# EAGLE design H4_PadController_Rev_1 (EAGLE 7.6.0)
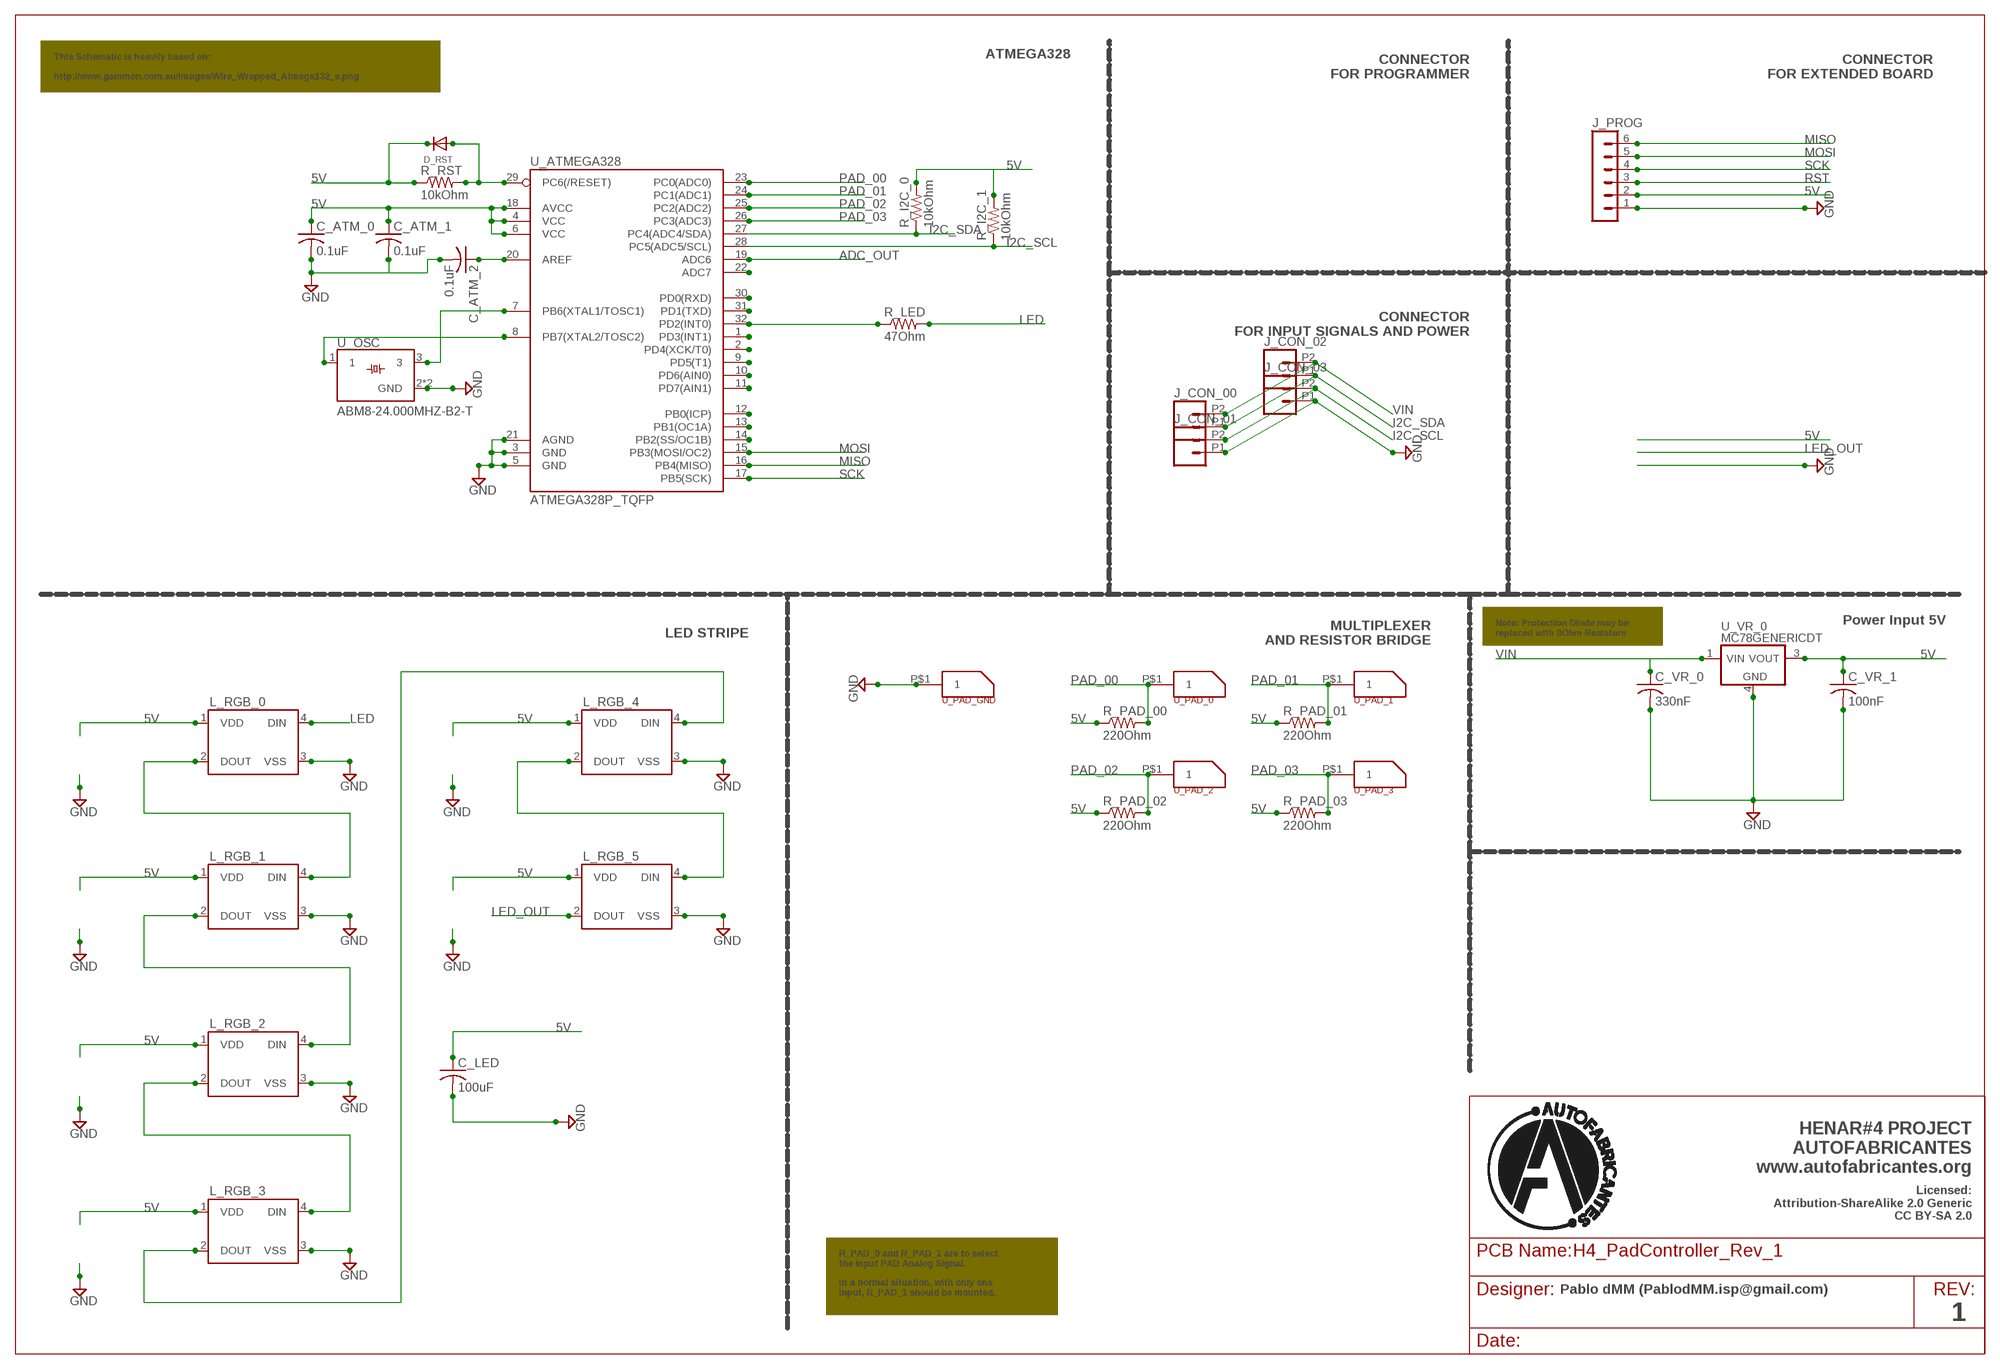
[diagram p0: schematic, sheet 1]

## Parts
C_ATM_0  0.1uF  C-USC0805  [C0805]
C_ATM_1  0.1uF  C-USC0805  [C0805]
C_ATM_2  0.1uF  C-USC0805  [C0805]
C_LED  100uF  C-USC1210  [C1210]
C_VR_0  330nF  C-USC0805  [C0805]
C_VR_1  100nF  C-USC0805  [C0805]
D_RST  DIODESOD-123  [SOD-123]
J_CON_00  M022.54MM_SCREWTERM  [1X02_2.54_SCREWTERM]
J_CON_01  M022.54MM_SCREWTERM  [1X02_2.54_SCREWTERM]
J_CON_02  M022.54MM_SCREWTERM  [1X02_2.54_SCREWTERM]
J_CON_03  M022.54MM_SCREWTERM  [1X02_2.54_SCREWTERM]
J_PROG  MA06-1  [MA06-1]
L_RGB_0  WS2812B  [WS2812B]
L_RGB_1  WS2812B  [WS2812B]
L_RGB_2  WS2812B  [WS2812B]
L_RGB_3  WS2812B  [WS2812B]
L_RGB_4  WS2812B  [WS2812B]
L_RGB_5  WS2812B  [WS2812B]
R_I2C_0  10kOhm  R-US_M0805  [M0805]
R_I2C_1  10kOhm  R-US_M0805  [M0805]
R_LED  47Ohm  R-US_M0805  [M0805]
R_PAD_00  220Ohm  R-US_M0805  [M0805]
R_PAD_01  220Ohm  R-US_M0805  [M0805]
R_PAD_02  220Ohm  R-US_M0805  [M0805]
R_PAD_03  220Ohm  R-US_M0805  [M0805]
R_RST  10kOhm  R-US_M0805  [M0805]
U_ATMEGA328  ATMEGA328P_TQFP  [TQFP32-08]
U_OSC  ABM8-24.000MHZ-B2-T  [OSCSC320X250X100N]
U_PAD_0  PAD_CONNECTOR_MULTI  [PAD_CONNECTOR_MULTI]
U_PAD_1  PAD_CONNECTOR_MULTI  [PAD_CONNECTOR_MULTI]
U_PAD_2  PAD_CONNECTOR_MULTI  [PAD_CONNECTOR_MULTI]
U_PAD_3  PAD_CONNECTOR_MULTI  [PAD_CONNECTOR_MULTI]
U_PAD_GND  PAD_CONNECTOR_MULTI  [PAD_CONNECTOR_MULTI]
U_VR_0  MC78GENERICDT  [DPAK-3]

## Nets
5V [GND]: C_ATM_0.1 C_ATM_1.1 C_LED.1 C_VR_1.1 D_RST.C J_PROG.2 L_RGB_0.1(VDD) L_RGB_1.1(VDD) L_RGB_2.1(VDD) L_RGB_3.1(VDD) L_RGB_4.1(VDD) L_RGB_5.1(VDD) R_I2C_0.2 R_I2C_1.2 R_PAD_00.1 R_PAD_01.1 R_PAD_02.1 R_PAD_03.1 R_RST.1 U_ATMEGA328.4(VCC) U_ATMEGA328.6(VCC) U_ATMEGA328.18(AVCC) U_VR_0.3(VOUT)
ADC_OUT: U_ATMEGA328.19(ADC6)
GND [GND]: C_ATM_0.2 C_ATM_1.2 C_ATM_2.2 C_LED.2 C_VR_0.2 C_VR_1.2 J_CON_01.P1 J_CON_03.P1 J_PROG.1 L_RGB_0.3(VSS) L_RGB_1.3(VSS) L_RGB_2.3(VSS) L_RGB_3.3(VSS) L_RGB_4.3(VSS) L_RGB_5.3(VSS) U_ATMEGA328.3(GND) U_ATMEGA328.5(GND) U_ATMEGA328.21(AGND) U_OSC.2(GND) U_OSC.4(GND) U_PAD_GND.P$1 U_VR_0.4(GND)
I2C_SCL: J_CON_01.P2 J_CON_03.P2 R_I2C_1.1 U_ATMEGA328.28(PC5(ADC5/SCL))
I2C_SDA: J_CON_00.P1 J_CON_02.P1 R_I2C_0.1 U_ATMEGA328.27(PC4(ADC4/SDA))
LED: L_RGB_0.4(DIN) R_LED.2
LED_OUT: L_RGB_5.2(DOUT)
LEDE: L_RGB_3.2(DOUT) L_RGB_4.4(DIN)
MISO: J_PROG.6 U_ATMEGA328.16(PB4(MISO))
MOSI: J_PROG.5 U_ATMEGA328.15(PB3(MOSI/OC2))
N$1: U_ATMEGA328.30(PD0(RXD))
N$2: U_ATMEGA328.7(PB6(XTAL1/TOSC1)) U_OSC.3
N$3: L_RGB_2.2(DOUT) L_RGB_3.4(DIN)
N$4: C_ATM_2.1 U_ATMEGA328.20(AREF)
N$5: U_ATMEGA328.8(PB7(XTAL2/TOSC2)) U_OSC.1
N$6: U_ATMEGA328.31(PD1(TXD))
N$8: R_LED.1 U_ATMEGA328.32(PD2(INT0))
N$9: L_RGB_1.2(DOUT) L_RGB_2.4(DIN)
N$10: L_RGB_0.2(DOUT) L_RGB_1.4(DIN)
N$13: U_ATMEGA328.22(ADC7)
N$14: L_RGB_4.2(DOUT) L_RGB_5.4(DIN)
N$16: U_ATMEGA328.1(PD3(INT1))
N$17: U_ATMEGA328.2(PD4(XCK/T0))
N$18: U_ATMEGA328.9(PD5(T1))
N$19: U_ATMEGA328.10(PD6(AIN0))
N$20: U_ATMEGA328.11(PD7(AIN1))
N$21: U_ATMEGA328.12(PB0(ICP))
N$22: U_ATMEGA328.13(PB1(OC1A))
N$23: U_ATMEGA328.14(PB2(SS/OC1B))
PAD_00: R_PAD_00.2 U_ATMEGA328.23(PC0(ADC0)) U_PAD_0.P$1
PAD_01: R_PAD_01.2 U_ATMEGA328.24(PC1(ADC1)) U_PAD_1.P$1
PAD_02: R_PAD_02.2 U_ATMEGA328.25(PC2(ADC2)) U_PAD_2.P$1
PAD_03: R_PAD_03.2 U_ATMEGA328.26(PC3(ADC3)) U_PAD_3.P$1
RST: D_RST.A J_PROG.3 R_RST.2 U_ATMEGA328.29(PC6(/RESET))
SCK: J_PROG.4 U_ATMEGA328.17(PB5(SCK))
VIN: C_VR_0.1 J_CON_00.P2 J_CON_02.P2 U_VR_0.1(VIN)

## Notes on the sheet
- This Schematic is heavily based on:
  
  http://www.gammon.com.au/images/Wire_Wrapped_Atmega132_e.png
- ATMEGA328
- CONNECTOR
  FOR PROGRAMMER
- CONNECTOR
  FOR EXTENDED BOARD
- CONNECTOR
  FOR INPUT SIGNALS AND POWER
- Note: Protection Diode may be
  replaced with 0Ohm Resistors
- Power Input 5V
- LED STRIPE
- MULTIPLEXER
  AND RESISTOR BRIDGE
- HENAR#4 PROJECT
  AUTOFABRICANTES
  www.autofabricantes.org
- Licensed:
  Attribution-ShareAlike 2.0 Generic
  CC BY-SA 2.0
- R_PAD_0 and R_PAD_1 are to select
  the Input PAD Analog Signal.
  
  In a normal situation, with only one
  Input, R_PAD_1 should be mounted.
- Pablo dMM (PablodMM.isp@gmail.com)
- 1

## Library data of the parts
C_ATM_0 C_ATM_1 C_ATM_2 C_LED C_VR_0 C_VR_1 = adafruit:C-US: CAPACITOR, American symbol
D_RST = microbuilder:DIODE: Diode SMA Model Volts Amps Type Vf Vr Digikey # Notes SSA34-E3 40V 3A Schottky 480mV @ 3A 200uA @ 40V SSA34-E3/61TGITR-ND CDBA120-G 20V 1A Schottky 500mV @ 1A 500uA @ 20V 641-1014-6-ND REEL MBRA210 10V 2A Schottky 350mV @ 2A 700uA @ 10V MBRA210LT3 SOD-123 Model Volts Amps Type Vf Vr Order # Notes BAT54T1G 30V 200mA Schottky 800mV @ 200mA 2uA @ 25V BAT54T1GOSTR-ND B0530W 30V 500mA Schottky 430mV @ 500mA 130uA @ 30V B0530W-FDICT-ND REEL MBR120 1A 20V Schottky 340mV @ 1A MBR120VLSFT1GOSCT-ND SOD-323 Model Volts Amps Type Vf Vr Order # Notes PMEG2005EJ 20V 500mA Schottky 355mV @ 500mA 568-4110-1-ND ZLLS410 10V 570mA Schottky 380mV @ 570mA ZLLS410CT-ND 1N4148WS 75V 150mA Silicon/Simple 1V 1N4148WSFSCT-ND REEL SOD-523 Model Volts Amps Type Vf Vr Order # Notes BAT54XV2 30V 200mA Schottky 0.8V @ 100mA BAT54XV2CT-ND TB751S 30V 30mA Schottky RB751S-40TE61CT-ND SOT23-R/W (R = Solder Paste/Reflow Ovens, W = Hand-Soldering) Model Volts Amps Type Vf Vr Order # Notes BAT54FILM 40V 300mA Schottky 497-7162-1-ND
J_CON_00 J_CON_01-J_CON_03 = SparkFun-Connectors:M02: Standard 2-pin 0.1" header. Use with - straight break away headers ( PRT-00116) - right angle break away headers (PRT-00553) - swiss pins (PRT-00743) - machine pins (PRT-00117) - female headers (PRT-00115) Molex polarized connector foot print use with: PRT-08233 with associated crimp pins and housings. 2.54_SCREWTERM for use with PRT-10571. 3.5mm Screw Terminal footprints for PRT-08084 5mm Screw Terminal footprints for use with PRT-08432
J_PROG = con-lstb:MA06-1: PIN HEADER; OC_FARNELL: unknown; OC_NEWARK: unknown
L_RGB_0 L_RGB_1-L_RGB_5 = SparkFun-LED:WS2812B: WS2812B - Intelligent control LED integrated light source Technical Specifications: Power Supply Voltage (VDD): 3.5 to 5.3 V Input Voltage (VI): -0.5 to VDD+0.5 V Operating Junction Temperature (Topt): -25°C to +80°C Storage Temperature Range (Tstg): -55°C to +150°C; PROD_ID: DIO-12503
R_I2C_0 R_I2C_1 R_LED R_PAD_00 R_PAD_01-R_PAD_03 R_RST = adafruit:R-US_: RESISTOR, American symbol
U_ATMEGA328 = SparkFun-DigitalIC:ATMEGA328P_TQFP; PROD_ID: IC-09069
U_OSC = ABM8-24.000MHZ-B2-T:ABM8-24.000MHZ-B2-T: Crystal 20MHz Â±20ppm (Tol) Â±30ppm (Stability) 18pF FUND 80Ohm 4-Pin Mini-CSMD T/R; AVAILABILITY: Unavailable; DESCRIPTION: 24MHz ±20ppm Crystal 18pF 50 Ohms 4-SMD, No Lead; MF: Abracon; MP: ABM8-24.000MHZ-B2-T; PACKAGE: SMD-4 Abracon; PRICE: None
U_PAD_0 U_PAD_1-U_PAD_3 U_PAD_GND = atfHenar_customLib:PAD_CONNECTOR_MULTI
U_VR_0 = _hhn_78xx_79xx_NCV78xx_d2pak_dpak:MC78*: 78xx SMD (D2PAK, DPAK) (MC)78xx..DT (DPAK-3; Rth,JA = 92 K/W) (MC)78xx..D2T (D2PAK-3; Rth,JA = 45 K/W @ 10x10mm copper area) Linear Voltage Regulators, Positive, 1 A (ON Semiconductor) Package dimenisions and soldering footprints acc. to ONSEMI specs. Source: http://onsemi.com Datasheet document#: MC7800/D Technologies: 78xxyD(2)Tz: xx = Output Voltage (V) y, z: additional suffixes see manufacturer's datasheet Author: Dipl.-Ing. FH Rainer Bayer HHN Hochschule Heilbronn, rainer.bayer@hs-heilbronn.de Ingenieurbüro ing-rb, mail@ing-rb.de

## Net classes
1 GND: width 0.381 mm
2 VCC: width 0.381 mm, clearance 0.305 mm to class 1

## Board
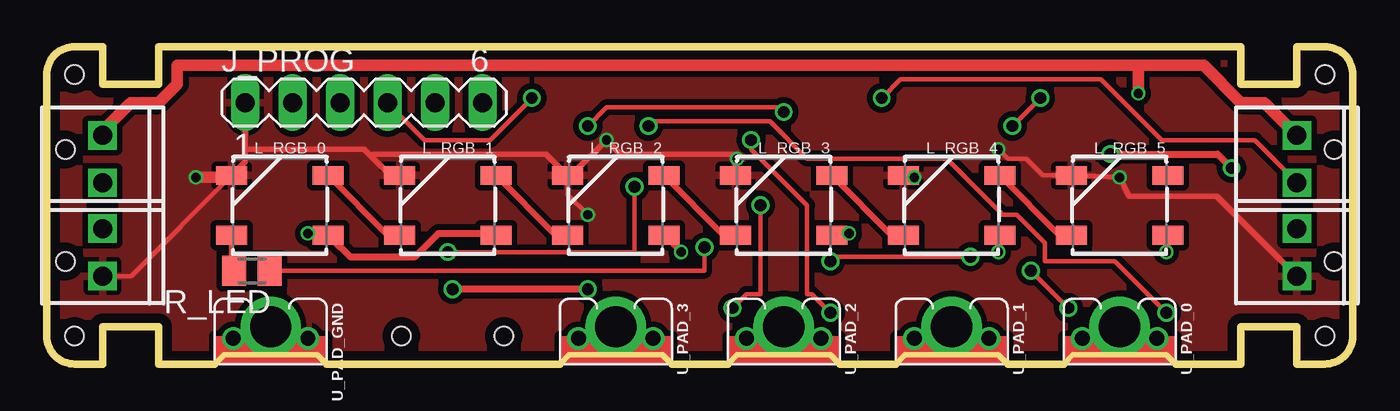
[diagram p1: board, top side]
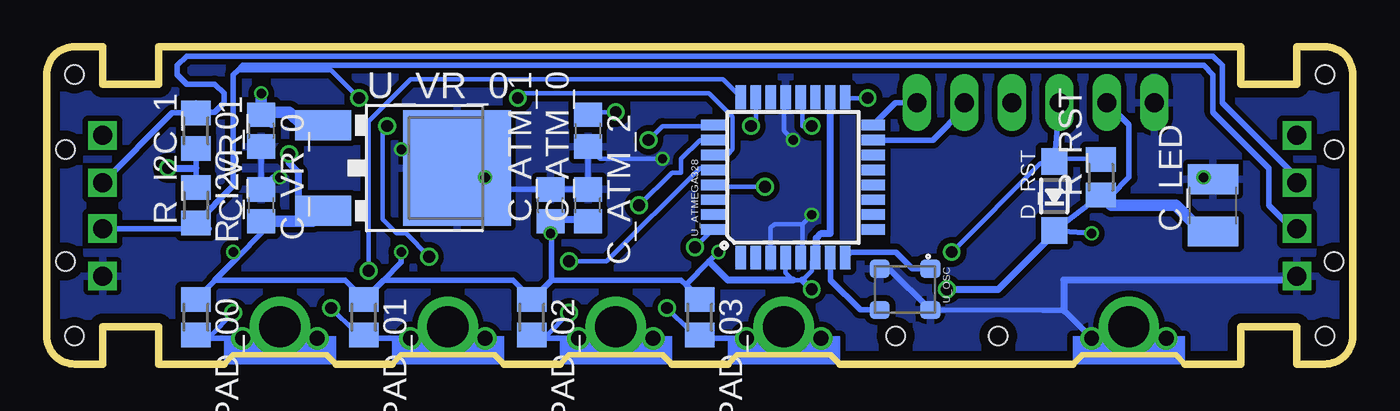
[diagram p2: board, bottom side, seen from below]

Size 70 x 17 mm. Coordinates in mm from the lower left corner, seen from the top.
Outline: 1.5,0 3,0 3,2 6,2 6,0 9,0 9.5,0.5 14.5,0.5 15,0 27.5,0 28,0.5 33,0.5 33.5,0 36.5,0 37,0.5 42,0.5 42.5,0 45.5,0 46,0.5 51,0.5 51.5,0 54.5,0 55,0.5 60,0.5 60.5,0 64,0 64,2 67,2 67,0 68.5,0 arc90 70,1.5 70,15.5 arc90 68.5,17 67,17 67,15 64,15 64,17 6,17 6,15 3,15 3,17 1.5,17 arc90 0,15.5 0,1.5 arc90 1.5,0
Copper layers (1*16): Top 0.035mm / dielectric 1.5mm / Bottom 0.035mm
Design rules "default *": minimum track width 10mil, minimum drill 25mil, track to track 10mil, track to pad 10mil, pad to pad 10mil, via to via 10mil, smd to smd 8mil, copper to edge 20mil, drill to drill 8mil, minimum pad ring 5mil, minimum via ring 5mil, stop-mask expansion 4mil, vias tented up to drill 0mil, thermal gap 10mil
Holes 1 mm at 69,5.5 69,11.5 1,11.5 1,5.5 68.5,15.5 68.5,1.5 1.5,1.5 1.5,15.5 19,1.5 24.5,1.5

### Footprints (pad centres in the part's own frame; a part is rotated, then mirrored left to right if it is on the bottom)
C0805 = smd 1.3 x 1.5: 1 -0.85,0; 2 0.85,0
C1210 = smd 1.6 x 2.7: 1 -1.4,0; 2 1.4,0
SOD-123 = smd 1.4 x 1.4: A 1.85,0; C -1.85,0
1X02_2.54_SCREWTERM = drill 1.016 square: P1 2.54,0; P2 0,0
MA06-1 = drill 1.016 long: 1 -6.35,0; 2 -3.81,0; 3 -1.27,0; 4 1.27,0; 5 3.81,0; 6 6.35,0
WS2812B = smd 1.651 x 1: 1 -2.577,1.6; 2 -2.577,-1.6; 3 2.577,-1.6; 4 2.577,1.6
M0805 = smd 1.3 x 1.6: 1 -0.95,0; 2 0.95,0
TQFP32-08 = smd 1.27 x 0.559: 1 -4.293,2.8; 2 -4.293,2; 3 -4.293,1.2; 4 -4.293,0.4; 5 -4.293,-0.4; 6 -4.293,-1.2; 7 -4.293,-2; 8 -4.293,-2.8; 17 4.293,-2.8; 18 4.293,-2; 19 4.293,-1.2; 20 4.293,-0.4; 21 4.293,0.4; 22 4.293,1.2; 23 4.293,2; 24 4.293,2.8 | smd 0.559 x 1.27: 9 -2.8,-4.293; 10 -2,-4.293; 11 -1.2,-4.293; 12 -0.4,-4.293; 13 0.4,-4.293; 14 1.2,-4.293; 15 2,-4.293; 16 2.8,-4.293; 25 2.8,4.293; 26 2,4.293; 27 1.2,4.293; 28 0.4,4.293; 29 -0.4,4.293; 30 -1.2,4.293; 31 -2,4.293; 32 -2.8,4.293
OSCSC320X250X100N = smd 0.98 x 1.1: 1 -1.104,1.354; 2 -1.104,-1.354; 3 1.104,-1.354; 4 1.104,1.354
PAD_CONNECTOR_MULTI = drill 0.8: P$1 0.63,2; P$2 0.63,-2 | drill 2.2: P$3 0,0
DPAK-3 = smd 1.6 x 3: 1 -2.286,-7.18; 3 2.286,-7.18 | smd 6.2 x 5.8: 4 0,0

### Placement (x,y rotation side)
C_ATM_0  41,8.5 90 bottom
C_ATM_1  43,8.5 90 bottom
C_ATM_2  41,12.5 270 bottom
C_LED  7.5,8.5 90 bottom
C_VR_0  58.5,12.5 270 bottom
C_VR_1  58.5,8.5 90 bottom
D_RST  16,9 90 bottom
J_CON_00  3,12.25 270 top
J_CON_01  67,7.25 270 top
J_CON_02  67,12.25 270 top
J_CON_03  3,7.25 270 top
J_PROG  17,14 0 top
L_RGB_0  12.5,8.5 180 top
L_RGB_1  21.5,8.5 180 top
L_RGB_2  30.5,8.5 180 top
L_RGB_3  39.5,8.5 180 top
L_RGB_4  48.5,8.5 180 top
L_RGB_5  57.5,8.5 180 top
R_I2C_0  62,12.5 270 bottom
R_I2C_1  62,8.5 90 bottom
R_LED  11,5 180 top
R_PAD_00  62,2.5 270 bottom
R_PAD_01  53,2.5 270 bottom
R_PAD_02  44,2.5 270 bottom
R_PAD_03  35,2.5 270 bottom
R_RST  13.5,10 90 bottom
U_ATMEGA328  30,10 90 bottom
U_OSC  24,4 270 bottom
U_PAD_0  57.5,2 270 top
U_PAD_1  48.5,2 270 top
U_PAD_2  39.5,2 270 top
U_PAD_3  30.5,2 270 top
U_PAD_GND  12,2 270 top
U_VR_0  48,10.5 270 bottom

### Tracks (layer width: path | path; a pad name or v marks a point on that pad's centre or on a via)
5V  (via drill 0.5 pad 0.25, 0.64)
  Top 0.305: v43,7 42.18,7 L_RGB_3.1 | v14,7 L_RGB_0.1 | L_RGB_5.1 60.08,6.08 v60,6 | L_RGB_4.1 51.08,6.08 v51,6 | L_RGB_2.1 33.1,6.9 v34,6
  Top 0.381: L_RGB_1.1 24,7 21,7 19.75,5.75 16.25,5.75 15.25,6.75 L_RGB_0.1 | v63.5,10.5 62.75,11.25 v57,11.25 | v29,4 v21.75,4
  Bottom 0.254: U_ATMEGA328.4 30.4,4.9 30,4.5 29.5,4.5 29,5 29,5.51 U_ATMEGA328.6
  Bottom 0.305: R_I2C_1.2 62,10.5 R_I2C_0.2 | U_VR_0.3 55.74,7.65 | 61,4.5 54,4.5 53,3.5 R_PAD_01.1 51.95,4.5 | 61,4.5 61,4.45 R_PAD_00.1 | 51.95,4.5 45,4.5 44,3.5 R_PAD_02.1 42.95,4.5 | R_PAD_03.1 35,3.5 35.75,4.25 | 35.75,4.25 36,4.5 42.95,4.5 | v43,7 C_ATM_1.1 42.95,7.6 42.95,4.5 | v14,7 D_RST.C R_RST.1 12.95,9.05 12,10 12,12.81 J_PROG.2 | 61,4.5 59.75,5.75 | 59.75,5.75 58.5,7 C_VR_1.1 | v60,6 59.75,5.75 | v51,6 51,5.45 51.95,4.5 | v34,6 34.5,5.5 35.75,4.25
  Bottom 0.381: C_ATM_0.1 41,7.75 43,7.75 C_ATM_1.1 | U_ATMEGA328.18 28,7 28.5,7 28.75,6.75 28.75,5.75 U_ATMEGA328.6 | 34.5,5.5 33.5,4.5 30,4.5 | v63.5,10.5 62,10.5 | v57,11.25 57,10.75 56.5,10.25 56.5,7.75 U_VR_0.3 | v21.75,4 19,4 16,7 D_RST.C | 29.5,4.5 v29,4
  Bottom 0.61: C_LED.1 8.1,7.1 9.5,8.5 12.95,8.5 R_RST.1 | 55.74,7.65 C_VR_1.1
FILLBOT
  pour Bottom (isolate 0.305): 3,17 1.5,17 arc90 0,15.5 0,1.5 arc90 1.5,0 3,0 3,2 6,2 6,0 64,0 64,2 67,2 67,0 68.5,0 arc90 70,1.5 70,15.5 arc90 68.5,17 67,17 67,15 64,15 64,17 6,17 6,15 3,15
FILLTOP
  pour Top (isolate 0.305): 1.5,17 arc90 0,15.5 0,1.5 arc90 1.5,0 3,0 3,2 6,2 6,0 64,0 64,2 67,2 67,0 68.5,0 arc90 70,1.5 70,15.5 arc90 68.5,17 67,17 67,15 64,15 64,17 6,17 6,15 3,15 3,17
GND  (via drill 0.5 pad 0.25)
  Top 0.254: J_CON_03.P1 4.53,4.71 L_RGB_0.3 | 28.1,10.1 L_RGB_2.3 27.92,9.08 v29,8 | 36.92,10.92 v37,11 | L_RGB_4.3 46.4,10.1 v46.5,10 | 54.9,10.1 53.4,10.1 52.5,11 51.5,11 v51,11.5
  Top 0.305: L_RGB_5.3 54.9,10.1 v57.5,10 58,9 62.71,9 J_CON_01.P1 | J_PROG.1 10.65,11.5 | 10.65,11.5 10.65,10.83 L_RGB_0.3 | 28.1,10.1 v30,12 30.75,11.25 36.75,11.25 v37,11 | L_RGB_3.3 36.92,10.92 | 18.4,10.1 17.38,11.12 | 17.38,11.12 17,11.5 10.65,11.5 | 27.75,10.25 26.75,11.25 17.5,11.25 17.38,11.12
  Top 0.381: 27.75,10.25 L_RGB_2.3
  Top 0.61: v8,10 9.82,10 L_RGB_0.3 | L_RGB_1.3 18.4,10.1
  Bottom 0.254: v30,12 30.5,12.5 30.5,14.19 U_ATMEGA328.21 | 29.5,7.5 29.5,5.81 U_ATMEGA328.5 | U_ATMEGA328.3 31.2,7.3 31,7.5 29.5,7.5 | 29.5,7.5 v29,8 | v37,11 40.35,11 C_ATM_2.2 | v46.5,10 47,10 47.25,9.75 | v51,11.5 49,11.5 U_VR_0.4
  Bottom 0.305: C_VR_0.2 C_VR_1.2 57.85,10 v57.5,10 | C_ATM_2.2 C_ATM_0.2 C_ATM_1.2 46.85,9.35 47.25,9.75 U_VR_0.4 | U_OSC.2 24.85,5.1 U_OSC.4 16.62,2.87 15.5,2.87 U_PAD_GND.P$1
  Bottom 0.381: 15.5,2.87 15.5,4.5 3,4.5 J_CON_03.P1
  Bottom 0.61: C_LED.2 7.9,9.9 v8,10
  pour Top (isolate 0.305): 1.5,17 arc90 0,15.5 0,1.5 arc90 1.5,0 3,0 3,2 6,2 6,0 64,0 64,2 67,2 67,0 68.5,0 arc90 70,1.5 70,15.5 arc90 68.5,17 67,17 67,15 64,15 64,17 6,17 6,15 3,15 3,17
  pour Bottom (isolate 0.305): 3,17 1.5,17 arc90 0,15.5 0,1.5 arc90 1.5,0 3,0 3,2 6,2 6,0 64,0 64,2 67,2 67,0 68.5,0 arc90 70,1.5 70,15.5 arc90 68.5,17 67,17 67,15 64,15 64,17 6,17 6,15 3,15
I2C_SCL  (via drill 0.64)
  Top 0.254: v42,5.5 42.25,5.75 v49.5,5.75 | v53.25,14.25 v51.75,12.75
  Bottom 0.254: v42,5.5 40,5.5 35,10.5 34.5,10.5 U_ATMEGA328.28 | v49.5,5.75 50.75,7 51.25,7 52,7.75 52,12.75 v51.75,12.75 | v53.25,14.25 54.75,15.75 59.75,15.75
  Bottom 0.305: J_CON_01.P2 61.3,7.25 R_I2C_1.1 60,9.55 60,15.5 59.75,15.75 59.5,16 8,16 7.5,15.5 7.5,13.5 4.5,10.5 4.5,8.5 3.25,7.25 J_CON_03.P2
I2C_SDA  (via drill 0.64)
  Top 0.254: v44.75,14.25 45.75,15.25 56.5,15.25 59.75,12 64.75,12 67,9.75 J_CON_02.P1
  Bottom 0.254: v44.75,14.25 44.5,14.5 34.5,14.5 33.25,13.25 33.25,11.5 33.5,11.25 34.25,11.25 U_ATMEGA328.27
  Bottom 0.305: J_CON_02.P1 63.26,13.45 R_I2C_0.1 | J_CON_00.P1 3,10 7,14 7,16 7.5,16.5 62.5,16.5 63,16 63,15.5 62.5,15 61,15 60.5,14.5 60.5,14 61,13.5 61.95,13.5 R_I2C_0.1 | 62,14 R_I2C_0.1 | 62.5,13.95 R_I2C_0.1
LED
  Top 0.305: 10,7 9.92,6.92 L_RGB_0.4 9.92,5.13 arc90 R_LED.2
LEDE
  Top 0.305: L_RGB_4.4 45.28,6.9 L_RGB_3.2
MISO
  Bottom 0.305: J_PROG.6 24.51,14 U_ATMEGA328.16
MOSI
  Bottom 0.305: J_PROG.5 20.81,13.69 22.5,12 U_ATMEGA328.15
N$2
  Bottom 0.305: U_OSC.3 26.4,2.9 28,4.5 U_ATMEGA328.7
N$3
  Top 0.305: L_RGB_3.4 36.28,6.9 L_RGB_2.2
N$4  (via drill 0.64)
  Top 0.254: v29,12.75 30,13.75 39.25,13.75 v39.5,13.5
  Bottom 0.254: v29,12.75 29.5,12.75 29.5,14.25 U_ATMEGA328.20 | v39.5,13.5 41,13.5 C_ATM_2.1
N$5
  Bottom 0.305: U_OSC.1 23.6,5.1 24.5,6 26.91,6 U_ATMEGA328.8
N$8  (via drill 0.64)
  Top 0.254: v35.25,6.25 35.25,5 R_LED.1
  Bottom 0.254: v35.25,6.25 34.5,7 U_ATMEGA328.32
N$9
  Top 0.305: L_RGB_2.4 27.28,6.9 L_RGB_1.2
N$10
  Top 0.305: L_RGB_1.4 18.28,6.9 L_RGB_0.2
N$14
  Top 0.305: L_RGB_5.4 54.28,6.9 L_RGB_4.2
PAD_00  (via drill 0.64)
  Top 0.254: v32.25,12.75 32.5,13 38.75,13 40.75,11 48.25,11 51.25,8 52,8 53.5,6.5 53.5,5.5 57.25,5.5 v60,2.75
  Bottom 0.254: U_ATMEGA328.23 32,12.75 v32.25,12.75 | v60,2.75 61.25,1.5 R_PAD_00.2
  Bottom 0.305: U_PAD_0.P$1 61.82,1.37 R_PAD_00.2
PAD_01  (via drill 0.64)
  Top 0.254: v54.75,3 v52.75,5
  Bottom 0.254: v52.75,5 52.75,13 50.5,15.25 33.75,15.25 33,14.5 U_ATMEGA328.24 | v54.75,3 53.5,1.75 53,1.75 R_PAD_01.2
  Bottom 0.305: U_PAD_1.P$1 52.82,1.37 R_PAD_01.2
PAD_02  (via drill 0.64)
  Top 0.254: v37.75,12 37.75,11.5 40.75,8.5 40.75,3.75 41,3.75 v42,2.75
  Bottom 0.254: v37.75,12 37,12.75 34.5,12.75 U_ATMEGA328.25 | v42,2.75 43.25,1.5 R_PAD_02.2
  Bottom 0.305: U_PAD_2.P$1 43.82,1.37 R_PAD_02.2
PAD_03  (via drill 0.64)
  Top 0.254: v38.25,8.5 38.25,3.75 37.5,3.75 v36.75,3
  Bottom 0.254: U_ATMEGA328.26 35,12 36,11 36,10.25 36.5,10.25 v38.25,8.5 | v36.75,3 35.5,1.75 35,1.75 R_PAD_03.2
  Bottom 0.305: U_PAD_3.P$1 34.82,1.37 R_PAD_03.2
RST  (via drill 0.64)
  Top 0.254: v31.5,9.5 31.5,6 v21.5,6
  Bottom 0.254: v31.5,9.5 34.25,9.5 U_ATMEGA328.29 | v21.5,6 16.75,10.75 16,10.75 D_RST.A 16,11 13.5,11 R_RST.2
  Bottom 0.305: D_RST.A J_PROG.3
SCK  (via drill 0.64)
  Top 0.254: v26,14.25 23.75,12 20.25,12 18.25,14 J_PROG.4
  Bottom 0.254: v26,14.25 27,14.25 U_ATMEGA328.17
VIN  (via drill 0.5 pad 0.25)
  Top 0.61: 3,12.5 4.5,14 6,14 7,15 7,16 58.5,16 | 58.5,16 62,16 64,14 65.25,14 J_CON_02.P2 | v58.5,14.5 58.5,16
  Top 0.813: J_CON_00.P2 3,12.5
  Bottom 0.305: 57.94,12.79 C_VR_0.1
  Bottom 0.61: v58.5,14.5 C_VR_0.1 58.35,13.5 57,13.5 56.29,12.79 U_VR_0.1

### Text on the board
t_Silk: GND | 5V | RST | SCK | MOSI | MISO | H4_PadController_Rev_1 | I2C: | VIN | Autofabricantes / Un instrumento para Henar / Spain, 2020 | VIN | VIN | SDA | SDA | LED_00 | LED_01 | LED_02 | LED_03 | LED_04 | LED_05 | SCL | SCL | GND | R_LED | GND | GND | PAD / GND | PAD / 03 | PAD / 02 | PAD / 01 | PAD / 00
b_Silk: GND | 5V | RST | SCK | MOSI | MISO | Licensed CC BY-SA 3.0 | U_ATMEGA328 | C_ATM_2 | U_VR | JCON_00/01 | J_PROG | J_CON_02/03 | C_VR_0 | R_I2C_1 | VIN | VIN | C_LED | C_ATM_1 | SDA | SDA | C_VR_1 | R_I2C_0 | R_RST | SCL | SCL | D_RST | U_OSC | C_ATM_0 | GND | R_PAD_03 | R_PAD_02 | R_PAD_01 | R_PAD_00 | GND